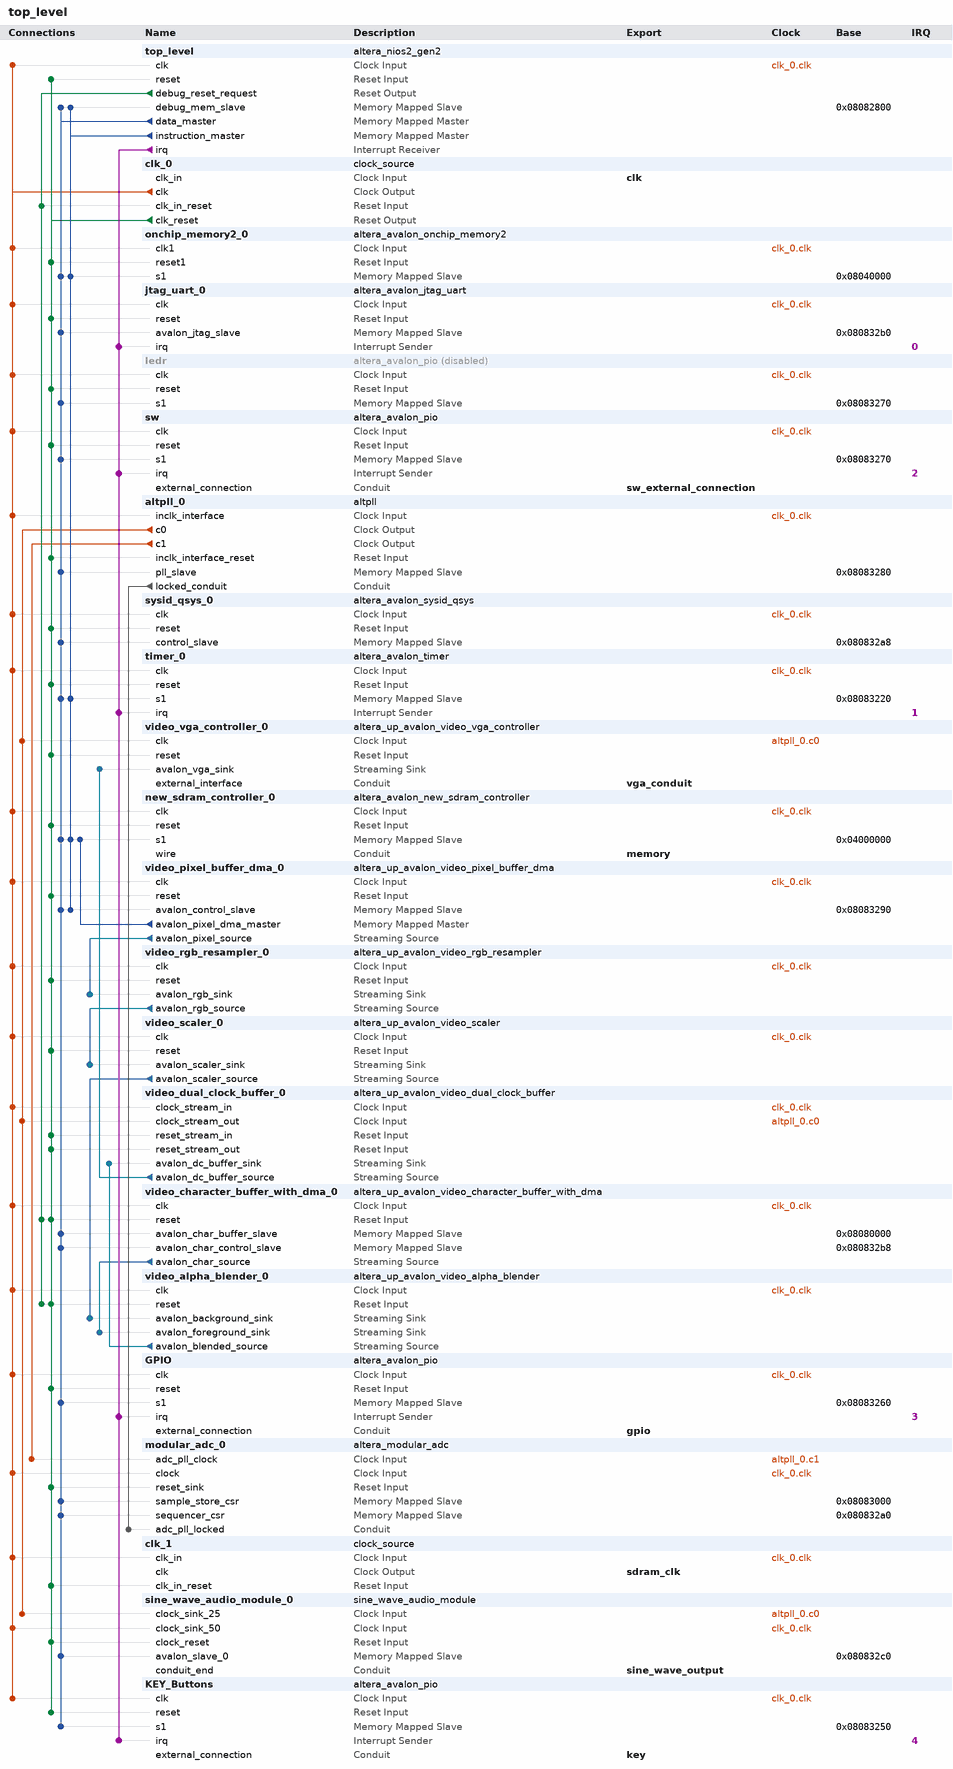
[diagram p0: system contents]
# Platform Designer (Qsys) system top_level, MAX 10 10M50DAF484C6GES
# Parameters at their usual value, and those the tool derives, are not listed.
package require -exact qsys 17.1
create_system top_level
set_project_property DEVICE_FAMILY {MAX 10}
set_project_property DEVICE 10M50DAF484C6GES

add_instance top_level altera_nios2_gen2 17.1
set_instance_parameter_value top_level dcache_size 2048
set_instance_parameter_value top_level exceptionSlave onchip_memory2_0.s1
set_instance_parameter_value top_level icache_size 4096
set_instance_parameter_value top_level impl Tiny
set_instance_parameter_value top_level resetSlave onchip_memory2_0.s1

add_instance clk_0 clock_source 17.1
set_instance_parameter_value clk_0 clockFrequency 50000000

add_instance onchip_memory2_0 altera_avalon_onchip_memory2 17.1
set_instance_parameter_value onchip_memory2_0 dataWidth 32
set_instance_parameter_value onchip_memory2_0 dualPort false
set_instance_parameter_value onchip_memory2_0 initMemContent true
set_instance_parameter_value onchip_memory2_0 initializationFileName onchip_mem.hex
set_instance_parameter_value onchip_memory2_0 memorySize 164000

add_instance jtag_uart_0 altera_avalon_jtag_uart 17.1
set_instance_parameter_value jtag_uart_0 simInteractiveOptions NO_INTERACTIVE_WINDOWS

add_instance ledr altera_avalon_pio 17.1
set_instance_property ledr ENABLED false
set_instance_parameter_value ledr direction Output
set_instance_parameter_value ledr width 8

add_instance sw altera_avalon_pio 17.1
set_instance_parameter_value sw captureEdge true
set_instance_parameter_value sw direction Input
set_instance_parameter_value sw edgeType ANY
set_instance_parameter_value sw generateIRQ true
set_instance_parameter_value sw irqType EDGE
set_instance_parameter_value sw width 8

add_instance altpll_0 altpll 17.1
set_instance_parameter_value altpll_0 CLK0_DIVIDE_BY 2
set_instance_parameter_value altpll_0 CLK0_MULTIPLY_BY 1
set_instance_parameter_value altpll_0 CLK1_DIVIDE_BY 5
set_instance_parameter_value altpll_0 CLK1_DUTY_CYCLE 50
set_instance_parameter_value altpll_0 CLK1_MULTIPLY_BY 1
set_instance_parameter_value altpll_0 CLK1_PHASE_SHIFT 0
set_instance_parameter_value altpll_0 CLK2_DIVIDE_BY 5
set_instance_parameter_value altpll_0 CLK2_DUTY_CYCLE 50
set_instance_parameter_value altpll_0 CLK2_MULTIPLY_BY 1
set_instance_parameter_value altpll_0 CLK2_PHASE_SHIFT 0
set_instance_parameter_value altpll_0 INCLK0_INPUT_FREQUENCY 20000
set_instance_parameter_value altpll_0 PORT_ARESET PORT_UNUSED
set_instance_parameter_value altpll_0 PORT_LOCKED PORT_USED
set_instance_parameter_value altpll_0 PORT_clk1 PORT_USED
set_instance_parameter_value altpll_0 PORT_clk2 PORT_UNUSED
set_instance_parameter_value altpll_0 PORT_clk3 PORT_UNUSED

add_instance sysid_qsys_0 altera_avalon_sysid_qsys 17.1
set_instance_parameter_value sysid_qsys_0 id 0

add_instance timer_0 altera_avalon_timer 17.1
set_instance_parameter_value timer_0 period 1
set_instance_parameter_value timer_0 periodUnits MSEC

add_instance video_vga_controller_0 altera_up_avalon_video_vga_controller 17.1
set_instance_parameter_value video_vga_controller_0 board DE10-Lite
set_instance_parameter_value video_vga_controller_0 resolution {VGA 640x480}

add_instance new_sdram_controller_0 altera_avalon_new_sdram_controller 17.1
set_instance_parameter_value new_sdram_controller_0 TAC 6.0
set_instance_parameter_value new_sdram_controller_0 TRCD 15.0
set_instance_parameter_value new_sdram_controller_0 TRFC 55.0
set_instance_parameter_value new_sdram_controller_0 TRP 15.0
set_instance_parameter_value new_sdram_controller_0 casLatency 2
set_instance_parameter_value new_sdram_controller_0 columnWidth 10
set_instance_parameter_value new_sdram_controller_0 dataWidth 16
set_instance_parameter_value new_sdram_controller_0 generateSimulationModel false
set_instance_parameter_value new_sdram_controller_0 initRefreshCommands 8
set_instance_parameter_value new_sdram_controller_0 model single_Micron_MT48LC4M32B2_7_chip
set_instance_parameter_value new_sdram_controller_0 numberOfBanks 4
set_instance_parameter_value new_sdram_controller_0 numberOfChipSelects 1
set_instance_parameter_value new_sdram_controller_0 powerUpDelay 100.0
set_instance_parameter_value new_sdram_controller_0 refreshPeriod 7.8125
set_instance_parameter_value new_sdram_controller_0 rowWidth 13

add_instance video_pixel_buffer_dma_0 altera_up_avalon_video_pixel_buffer_dma 17.1
set_instance_parameter_value video_pixel_buffer_dma_0 addr_mode X-Y
set_instance_parameter_value video_pixel_buffer_dma_0 back_start_address 268435456
set_instance_parameter_value video_pixel_buffer_dma_0 color_space {16-bit RGB}
set_instance_parameter_value video_pixel_buffer_dma_0 image_height 240
set_instance_parameter_value video_pixel_buffer_dma_0 image_width 320
set_instance_parameter_value video_pixel_buffer_dma_0 start_address 268435456

add_instance video_rgb_resampler_0 altera_up_avalon_video_rgb_resampler 17.1
set_instance_parameter_value video_rgb_resampler_0 alpha 1023
set_instance_parameter_value video_rgb_resampler_0 input_type {16-bit RGB}
set_instance_parameter_value video_rgb_resampler_0 output_type {30-bit RGB}

add_instance video_scaler_0 altera_up_avalon_video_scaler 17.1
set_instance_parameter_value video_scaler_0 color_bits 10
set_instance_parameter_value video_scaler_0 color_planes 3
set_instance_parameter_value video_scaler_0 height_scaling 2
set_instance_parameter_value video_scaler_0 width_in 320
set_instance_parameter_value video_scaler_0 width_scaling 2

add_instance video_dual_clock_buffer_0 altera_up_avalon_video_dual_clock_buffer 17.1
set_instance_parameter_value video_dual_clock_buffer_0 color_bits 10

add_instance video_character_buffer_with_dma_0 altera_up_avalon_video_character_buffer_with_dma 17.1
set_instance_parameter_value video_character_buffer_with_dma_0 enable_transparency true

add_instance video_alpha_blender_0 altera_up_avalon_video_alpha_blender 17.1

add_instance GPIO altera_avalon_pio 17.1
set_instance_parameter_value GPIO captureEdge true
set_instance_parameter_value GPIO direction Input
set_instance_parameter_value GPIO generateIRQ true
set_instance_parameter_value GPIO irqType EDGE
set_instance_parameter_value GPIO width 4

add_instance modular_adc_0 altera_modular_adc 17.1
set_instance_parameter_value modular_adc_0 CLOCK_FREQ 50000000
set_instance_parameter_value modular_adc_0 CORE_VAR 0
set_instance_parameter_value modular_adc_0 DEVICE_PART 10M50DAF484C6GES
set_instance_parameter_value modular_adc_0 clkdiv 2
set_instance_parameter_value modular_adc_0 int_vref_vr 3.0
set_instance_parameter_value modular_adc_0 refsel 1
set_instance_parameter_value modular_adc_0 sample_rate 0
set_instance_parameter_value modular_adc_0 seq_order_length 4
set_instance_parameter_value modular_adc_0 seq_order_slot_1 1
set_instance_parameter_value modular_adc_0 seq_order_slot_2 2
set_instance_parameter_value modular_adc_0 seq_order_slot_3 3
set_instance_parameter_value modular_adc_0 seq_order_slot_4 4
set_instance_parameter_value modular_adc_0 seq_order_slot_5 30
set_instance_parameter_value modular_adc_0 seq_order_slot_6 30
set_instance_parameter_value modular_adc_0 seq_order_slot_7 30
set_instance_parameter_value modular_adc_0 use_ch0 true
set_instance_parameter_value modular_adc_0 use_ch2 true
set_instance_parameter_value modular_adc_0 use_ch3 true
set_instance_parameter_value modular_adc_0 use_ch4 true
set_instance_parameter_value modular_adc_0 use_ch5 false
set_instance_parameter_value modular_adc_0 use_ch6 false
set_instance_parameter_value modular_adc_0 use_ch7 false
set_instance_parameter_value modular_adc_0 use_ch8 false
set_instance_parameter_value modular_adc_0 use_tsd false

add_instance clk_1 clock_source 17.1
set_instance_parameter_value clk_1 clockFrequency 50000000

add_instance sine_wave_audio_module_0 sine_wave_audio_module 1.0

add_instance KEY_Buttons altera_avalon_pio 17.1
set_instance_parameter_value KEY_Buttons captureEdge true
set_instance_parameter_value KEY_Buttons direction Input
set_instance_parameter_value KEY_Buttons generateIRQ true
set_instance_parameter_value KEY_Buttons irqType EDGE
set_instance_parameter_value KEY_Buttons width 2

# connections
add_connection altpll_0.c0 sine_wave_audio_module_0.clock_sink_25 clock
add_connection altpll_0.c0 video_dual_clock_buffer_0.clock_stream_out clock
add_connection altpll_0.c0 video_vga_controller_0.clk clock
add_connection altpll_0.c1 modular_adc_0.adc_pll_clock clock
add_connection clk_0.clk altpll_0.inclk_interface clock
add_connection clk_0.clk clk_1.clk_in clock
add_connection clk_0.clk GPIO.clk clock
add_connection clk_0.clk jtag_uart_0.clk clock
add_connection clk_0.clk KEY_Buttons.clk clock
add_connection clk_0.clk ledr.clk clock
add_connection clk_0.clk modular_adc_0.clock clock
add_connection clk_0.clk new_sdram_controller_0.clk clock
add_connection clk_0.clk onchip_memory2_0.clk1 clock
add_connection clk_0.clk sine_wave_audio_module_0.clock_sink_50 clock
add_connection clk_0.clk sw.clk clock
add_connection clk_0.clk sysid_qsys_0.clk clock
add_connection clk_0.clk timer_0.clk clock
add_connection clk_0.clk top_level.clk clock
add_connection clk_0.clk video_alpha_blender_0.clk clock
add_connection clk_0.clk video_character_buffer_with_dma_0.clk clock
add_connection clk_0.clk video_dual_clock_buffer_0.clock_stream_in clock
add_connection clk_0.clk video_pixel_buffer_dma_0.clk clock
add_connection clk_0.clk video_rgb_resampler_0.clk clock
add_connection clk_0.clk video_scaler_0.clk clock
add_connection clk_0.clk_reset altpll_0.inclk_interface_reset reset
add_connection clk_0.clk_reset clk_1.clk_in_reset reset
add_connection clk_0.clk_reset GPIO.reset reset
add_connection clk_0.clk_reset jtag_uart_0.reset reset
add_connection clk_0.clk_reset KEY_Buttons.reset reset
add_connection clk_0.clk_reset ledr.reset reset
add_connection clk_0.clk_reset modular_adc_0.reset_sink reset
add_connection clk_0.clk_reset new_sdram_controller_0.reset reset
add_connection clk_0.clk_reset onchip_memory2_0.reset1 reset
add_connection clk_0.clk_reset sine_wave_audio_module_0.clock_reset reset
add_connection clk_0.clk_reset sw.reset reset
add_connection clk_0.clk_reset sysid_qsys_0.reset reset
add_connection clk_0.clk_reset timer_0.reset reset
add_connection clk_0.clk_reset top_level.reset reset
add_connection clk_0.clk_reset video_alpha_blender_0.reset reset
add_connection clk_0.clk_reset video_character_buffer_with_dma_0.reset reset
add_connection clk_0.clk_reset video_dual_clock_buffer_0.reset_stream_in reset
add_connection clk_0.clk_reset video_dual_clock_buffer_0.reset_stream_out reset
add_connection clk_0.clk_reset video_pixel_buffer_dma_0.reset reset
add_connection clk_0.clk_reset video_rgb_resampler_0.reset reset
add_connection clk_0.clk_reset video_scaler_0.reset reset
add_connection clk_0.clk_reset video_vga_controller_0.reset reset
add_connection top_level.debug_reset_request clk_0.clk_in_reset reset
add_connection top_level.debug_reset_request video_alpha_blender_0.reset reset
add_connection top_level.debug_reset_request video_character_buffer_with_dma_0.reset reset
add_connection top_level.data_master altpll_0.pll_slave avalon
set_connection_parameter_value top_level.data_master/altpll_0.pll_slave baseAddress 0x08083280
add_connection top_level.data_master GPIO.s1 avalon
set_connection_parameter_value top_level.data_master/GPIO.s1 baseAddress 0x08083260
add_connection top_level.data_master jtag_uart_0.avalon_jtag_slave avalon
set_connection_parameter_value top_level.data_master/jtag_uart_0.avalon_jtag_slave baseAddress 0x080832b0
add_connection top_level.data_master KEY_Buttons.s1 avalon
set_connection_parameter_value top_level.data_master/KEY_Buttons.s1 baseAddress 0x08083250
add_connection top_level.data_master ledr.s1 avalon
set_connection_parameter_value top_level.data_master/ledr.s1 baseAddress 0x08083270
add_connection top_level.data_master modular_adc_0.sample_store_csr avalon
set_connection_parameter_value top_level.data_master/modular_adc_0.sample_store_csr baseAddress 0x08083000
add_connection top_level.data_master modular_adc_0.sequencer_csr avalon
set_connection_parameter_value top_level.data_master/modular_adc_0.sequencer_csr baseAddress 0x080832a0
add_connection top_level.data_master new_sdram_controller_0.s1 avalon
set_connection_parameter_value top_level.data_master/new_sdram_controller_0.s1 baseAddress 0x04000000
add_connection top_level.data_master onchip_memory2_0.s1 avalon
set_connection_parameter_value top_level.data_master/onchip_memory2_0.s1 baseAddress 0x08040000
add_connection top_level.data_master sine_wave_audio_module_0.avalon_slave_0 avalon
set_connection_parameter_value top_level.data_master/sine_wave_audio_module_0.avalon_slave_0 baseAddress 0x080832c0
add_connection top_level.data_master sw.s1 avalon
set_connection_parameter_value top_level.data_master/sw.s1 baseAddress 0x08083270
add_connection top_level.data_master sysid_qsys_0.control_slave avalon
set_connection_parameter_value top_level.data_master/sysid_qsys_0.control_slave baseAddress 0x080832a8
add_connection top_level.data_master timer_0.s1 avalon
set_connection_parameter_value top_level.data_master/timer_0.s1 baseAddress 0x08083220
add_connection top_level.data_master top_level.debug_mem_slave avalon
set_connection_parameter_value top_level.data_master/top_level.debug_mem_slave baseAddress 0x08082800
add_connection top_level.data_master video_character_buffer_with_dma_0.avalon_char_buffer_slave avalon
set_connection_parameter_value top_level.data_master/video_character_buffer_with_dma_0.avalon_char_buffer_slave baseAddress 0x08080000
add_connection top_level.data_master video_character_buffer_with_dma_0.avalon_char_control_slave avalon
set_connection_parameter_value top_level.data_master/video_character_buffer_with_dma_0.avalon_char_control_slave baseAddress 0x080832b8
add_connection top_level.data_master video_pixel_buffer_dma_0.avalon_control_slave avalon
set_connection_parameter_value top_level.data_master/video_pixel_buffer_dma_0.avalon_control_slave baseAddress 0x08083290
add_connection top_level.instruction_master new_sdram_controller_0.s1 avalon
set_connection_parameter_value top_level.instruction_master/new_sdram_controller_0.s1 baseAddress 0x04000000
add_connection top_level.instruction_master onchip_memory2_0.s1 avalon
set_connection_parameter_value top_level.instruction_master/onchip_memory2_0.s1 baseAddress 0x08040000
add_connection top_level.instruction_master timer_0.s1 avalon
set_connection_parameter_value top_level.instruction_master/timer_0.s1 baseAddress 0x08083220
add_connection top_level.instruction_master top_level.debug_mem_slave avalon
set_connection_parameter_value top_level.instruction_master/top_level.debug_mem_slave baseAddress 0x08082800
add_connection top_level.instruction_master video_pixel_buffer_dma_0.avalon_control_slave avalon
set_connection_parameter_value top_level.instruction_master/video_pixel_buffer_dma_0.avalon_control_slave baseAddress 0x08083290
add_connection video_pixel_buffer_dma_0.avalon_pixel_dma_master new_sdram_controller_0.s1 avalon
set_connection_parameter_value video_pixel_buffer_dma_0.avalon_pixel_dma_master/new_sdram_controller_0.s1 baseAddress 0x04000000
add_connection video_alpha_blender_0.avalon_blended_source video_dual_clock_buffer_0.avalon_dc_buffer_sink avalon_streaming
add_connection video_character_buffer_with_dma_0.avalon_char_source video_alpha_blender_0.avalon_foreground_sink avalon_streaming
add_connection video_dual_clock_buffer_0.avalon_dc_buffer_source video_vga_controller_0.avalon_vga_sink avalon_streaming
add_connection video_pixel_buffer_dma_0.avalon_pixel_source video_rgb_resampler_0.avalon_rgb_sink avalon_streaming
add_connection video_rgb_resampler_0.avalon_rgb_source video_scaler_0.avalon_scaler_sink avalon_streaming
add_connection video_scaler_0.avalon_scaler_source video_alpha_blender_0.avalon_background_sink avalon_streaming
add_connection altpll_0.locked_conduit modular_adc_0.adc_pll_locked conduit
add_connection top_level.irq GPIO.irq interrupt
set_connection_parameter_value top_level.irq/GPIO.irq irqNumber 3
add_connection top_level.irq jtag_uart_0.irq interrupt
set_connection_parameter_value top_level.irq/jtag_uart_0.irq irqNumber 0
add_connection top_level.irq KEY_Buttons.irq interrupt
set_connection_parameter_value top_level.irq/KEY_Buttons.irq irqNumber 4
add_connection top_level.irq sw.irq interrupt
set_connection_parameter_value top_level.irq/sw.irq irqNumber 2
add_connection top_level.irq timer_0.irq interrupt
set_connection_parameter_value top_level.irq/timer_0.irq irqNumber 1

# exported interfaces
add_interface clk clock sink
set_interface_property clk EXPORT_OF clk_0.clk_in
add_interface gpio conduit end
set_interface_property gpio EXPORT_OF GPIO.external_connection
add_interface key conduit end
set_interface_property key EXPORT_OF KEY_Buttons.external_connection
add_interface memory conduit end
set_interface_property memory EXPORT_OF new_sdram_controller_0.wire
add_interface sdram_clk clock source
set_interface_property sdram_clk EXPORT_OF clk_1.clk
add_interface sine_wave_output conduit end
set_interface_property sine_wave_output EXPORT_OF sine_wave_audio_module_0.conduit_end
add_interface sw_external_connection conduit end
set_interface_property sw_external_connection EXPORT_OF sw.external_connection
add_interface vga_conduit conduit end
set_interface_property vga_conduit EXPORT_OF video_vga_controller_0.external_interface

set_interconnect_requirement {$system} qsys_mm.clockCrossingAdapter HANDSHAKE
set_interconnect_requirement {$system} qsys_mm.enableEccProtection FALSE
set_interconnect_requirement {$system} qsys_mm.insertDefaultSlave FALSE
set_interconnect_requirement {$system} qsys_mm.maxAdditionalLatency 1

save_system top_level.qsys
